# Altium schematic sheet SENSOR.SchDoc
size A4
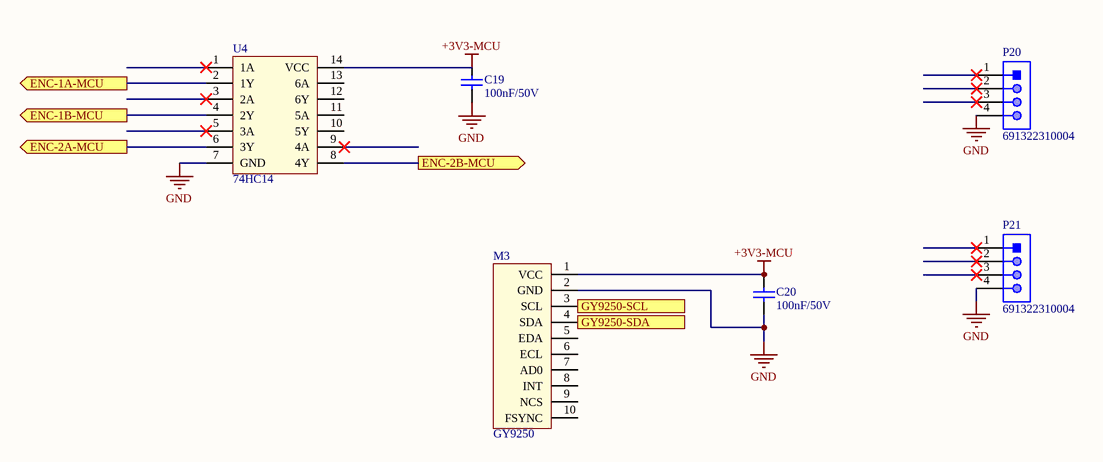
[diagram p0: SENSOR.SchDoc]

## Parts
C19  value 100nF/50V  [CAP-SM-0805]  (hidden comment: Cap-100nF-50V-0805)
C20  value 100nF/50V  [CAP-SM-0805]  (hidden comment: Cap-100nF-50V-0805)
M3  GY9250  [GY9250]
P20  691322310004  [691322310004]
P21  691322310004  [691322310004]
U4  74HC14  [74HC14D,652]

## Ports
ENC-1A-MCU (out), ENC-1B-MCU (out), ENC-2A-MCU (out), ENC-2B-MCU (out), GY9250-SCL, GY9250-SDA

## Nets
+3V3-MCU: C20.2 M3.1(VCC) U4.14(VCC)
GND: C19.1 C20.1 M3.2(GND) P20.4 P21.4 U4.7(GND)
ENC-1A-MCU: U4.2(1Y) ; port ENC-1A-MCU
ENC-1B-MCU: U4.4(2Y) ; port ENC-1B-MCU
ENC-2A-MCU: U4.6(3Y) ; port ENC-2A-MCU
ENC-2B-MCU: U4.8(4Y) ; port ENC-2B-MCU
GY9250-SCL: M3.3(SCL) ; port GY9250-SCL
GY9250-SDA: M3.4(SDA) ; port GY9250-SDA

Not connected (* = marked no-connect by the designer): C19 2; M3 5(EDA) 6(ECL) 7(AD0) 8(INT) 9(NCS) 10(FSYNC); P20 1* 2* 3*; P21 1* 2* 3*; U4 1(1A)* 3(2A)* 5(3A)* 9(4A)* 10(5Y) 11(5A) 12(6Y) 13(6A)

## Library data of the parts
C19 C20 = Cap-100nF-50V-0805: CAP CER 0.1UF 50V Y5V 0805; Manufacturer: Samsung Electro-Mechanics; Manufacturer Part Number: CL21F104ZBCNNNC; Local Supplier: thegioiic; Local Supplier Link: https://thegioiic.com/products/tu-100nf-0-1uf-50v-0805; Supplier 1: Digikey; Supplier 1 Part Number: 1276-1007-1-ND; Supplier 1 Link: https://www.digikey.com/product-detail/en/samsung-electro-mechanics/CL21F104ZBCNNNC/1276-1007-1-ND/3889093
P20 P21 = 691322310004: WR-TBL Serie 322 Horizontal PCB Header, Pluggable, pitch 3.81mm, 4p; Compliance: RoHS; Modularity: No; Pin Number: 4; Rated Current [UL]: 10A; Working Voltage [UL]: 300VAC; ComponentLink1Description: Manufacturer; ComponentLink1URL: http://www.we-online.de; ComponentLink2URL: https://katalog.we-online.de/em/datasheet/691322310004.pdf; ComponentLink2Description: Datasheet; Mounting Technology: THT; Part Number: 691322310004; Packaging: Box; Operating Temperature: -40 to +105degC; PCB/Cable/Panel: PCB; Pitch: 3.81mm; Published Date: October 2019; Type: Horizontal; Publisher: Wurth Elektronik; Application: Pluggable